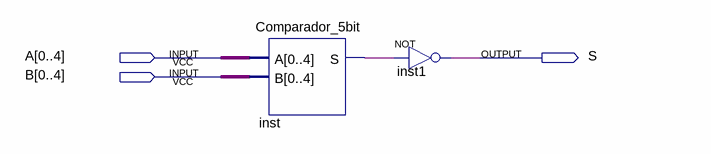
[diagram p0: schematic sheet]
// Quartus schematic Comparador_5bit_Menor_Igual.bdf as structural Verilog: 2 symbols, 3 pins
module Comparador_5bit_Menor_Igual (
  input  [0:4] A,
  input  [0:4] B,
  output S
);

  wire inst_s;

  Comparador_5bit inst (.A(A), .B(B), .S(inst_s));
  not inst1 (S, inst_s);
endmodule
